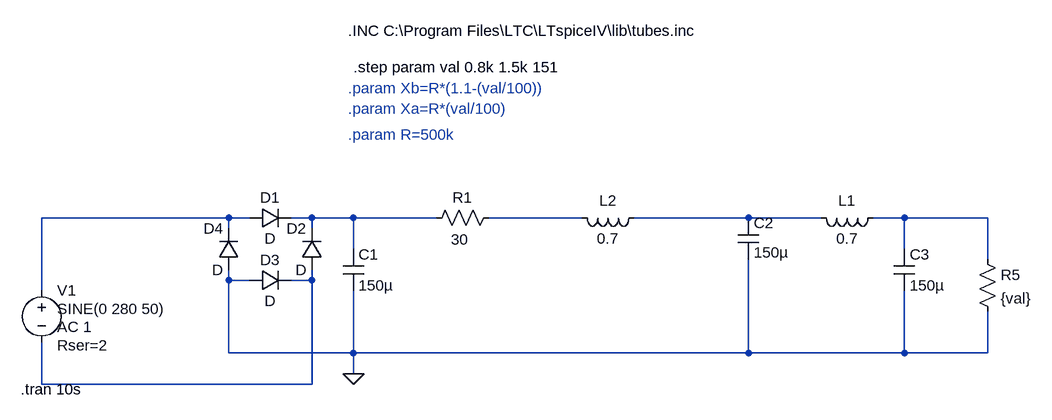
[diagram p0: schematic Napajanje_lin.asc]
Napajanje_lin.asc, the LTspice schematic file:
Version 4
SHEET 1 1532 680
WIRE 272 16 -16 16
WIRE 304 16 272 16
WIRE 400 16 368 16
WIRE 464 16 400 16
WIRE 592 16 464 16
WIRE 816 16 672 16
WIRE 1072 16 896 16
WIRE 1184 16 1072 16
WIRE 1312 16 1264 16
WIRE 1440 16 1312 16
WIRE 272 32 272 16
WIRE 400 32 400 16
WIRE 464 64 464 16
WIRE 1312 64 1312 16
WIRE 1440 80 1440 16
WIRE 272 112 272 96
WIRE 304 112 272 112
WIRE 400 112 400 96
WIRE 400 112 368 112
WIRE -16 128 -16 16
WIRE 272 224 272 112
WIRE 464 224 464 128
WIRE 464 224 272 224
WIRE 1072 224 1072 80
WIRE 1072 224 464 224
WIRE 1312 224 1312 128
WIRE 1312 224 1072 224
WIRE 1440 224 1440 160
WIRE 1440 224 1312 224
WIRE 464 256 464 224
WIRE -16 272 -16 208
WIRE 400 272 400 112
WIRE 400 272 -16 272
FLAG 464 256 0
SYMBOL voltage -16 112 R0
WINDOW 3 24 44 Left 2
WINDOW 123 24 72 Left 2
WINDOW 39 24 100 Left 2
SYMATTR Value SINE(0 280 50)
SYMATTR Value2 AC 1
SYMATTR SpiceLine Rser=2
SYMATTR InstName V1
SYMBOL diode 304 32 R270
WINDOW 0 32 32 VTop 2
WINDOW 3 0 32 VBottom 2
SYMATTR InstName D1
SYMBOL diode 416 96 R180
WINDOW 0 24 64 Left 2
WINDOW 3 24 0 Left 2
SYMATTR InstName D2
SYMBOL diode 304 128 R270
WINDOW 0 32 32 VTop 2
WINDOW 3 0 32 VBottom 2
SYMATTR InstName D3
SYMBOL diode 288 96 R180
WINDOW 0 24 64 Left 2
WINDOW 3 24 0 Left 2
SYMATTR InstName D4
SYMBOL cap 448 64 R0
SYMATTR InstName C1
SYMATTR Value 150µ
SYMATTR SpiceLine Rser=2
SYMBOL res 1424 64 R0
SYMATTR InstName R5
SYMATTR Value {val}
SYMBOL cap 1056 16 R0
WINDOW 3 24 53 Left 2
SYMATTR Value 150µ
SYMATTR InstName C2
SYMATTR SpiceLine Rser=2
SYMBOL ind 1280 0 R90
WINDOW 0 5 56 VBottom 2
WINDOW 3 32 56 VTop 2
SYMATTR InstName L1
SYMATTR Value 0.7
SYMATTR SpiceLine Rser=7
SYMBOL cap 1296 64 R0
SYMATTR InstName C3
SYMATTR Value 150µ
SYMATTR SpiceLine Rser=2
SYMBOL ind 912 0 R90
WINDOW 0 5 56 VBottom 2
WINDOW 3 32 56 VTop 2
SYMATTR InstName L2
SYMATTR Value 0.7
SYMATTR SpiceLine Rser=7
SYMBOL res 688 0 R90
WINDOW 0 0 56 VBottom 2
WINDOW 3 34 60 VTop 2
SYMATTR InstName R1
SYMATTR Value 30
TEXT -48 280 Left 2 !.tran 10s
TEXT 456 -184 Left 2 ;.param Xb=R*(1.1-(val/100))
TEXT 456 -152 Left 2 ;.param Xa=R*(val/100)
TEXT 456 -112 Left 2 ;.param R=500k
TEXT 464 -216 Left 2 !.step param val 0.8k 1.5k 151
TEXT 456 -272 Left 2 !.INC C:\\Program Files\\LTC\\LTspiceIV\\lib\\tubes.inc

The netlist it stands for:
* Napajanje_lin.asc
V1 N001 N006 SINE(0 280 50) AC 1 Rser=2
D1 N001 N002 D
D2 N006 N002 D
D3 0 N006 D
D4 0 N001 D
C1 N002 0 150µ Rser=2
R5 N005 0 {val}
C2 N004 0 150µ Rser=2
L1 N005 N004 0.7 Rser=7
C3 N005 0 150µ Rser=2
L2 N004 N003 0.7 Rser=7
R1 N003 N002 30
.model D D
.lib standard.dio
.tran 10s
* .param Xb=R*(1.1-(val/100))
* .param Xa=R*(val/100)
* .param R=500k
.step param val 0.8k 1.5k 151
.INC C:\Program Files\LTC\LTspiceIV\lib\tubes.inc
.backanno
.end